# EAGLE design c64-uni-cart-rev5 (EAGLE 9.6.2)
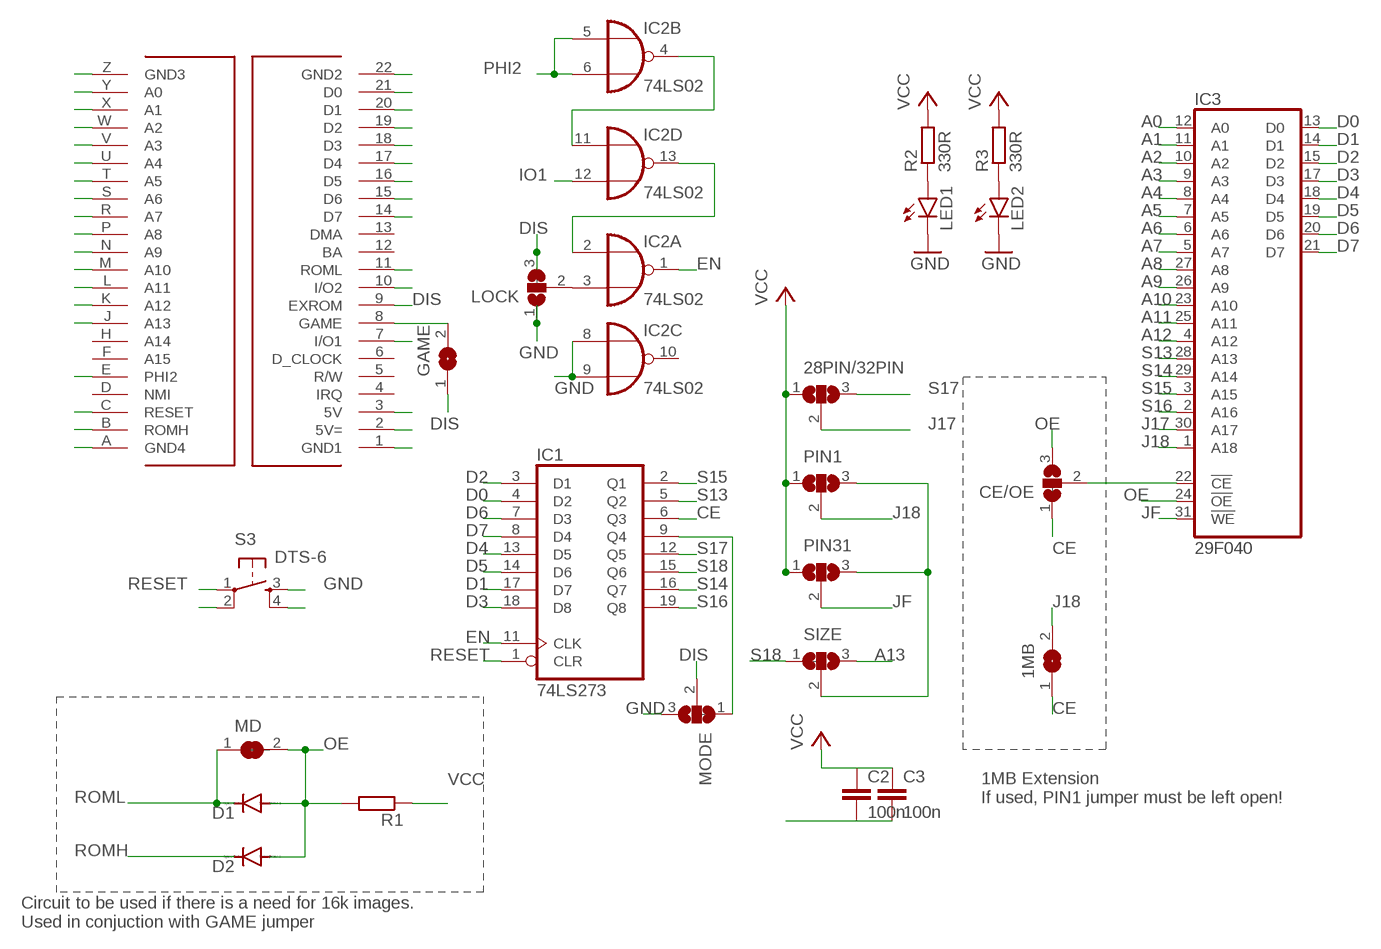
[diagram p0: schematic, sheet 1]

## Parts
1MB  SJ  [SJ]
28PIN/32PIN  SJ2W  [SJ_2]
C2  100n  C-EU025-024X044  [C025-024X044]
C3  100n  C-EU025-024X044  [C025-024X044]
CE/OE  SJ2W  [SJ_2]
D1  DIODE-MINIMELF  [MINIMELF]
D2  DIODE-MINIMELF  [MINIMELF]
GAME  SJ  [SJ]
IC1  74LS273  74HCT273N  [DIL20]
IC2  74LS02  74LS02N  [DIL14]
IC3  29F040  AM29F040N  [DIL32-6]
LED1  LED3MM  [LED3MM]
LED2  LED3MM  [LED3MM]
LOCK  SJ2W  [SJ_2]
MD  SJ  [SJ]
MODE  SJ2W  [SJ_2]
PIN1  SJ2W  [SJ_2]
PIN31  SJ2W  [SJ_2]
R1  R-EU_R1206  [R1206]
R2  330R  R-EU_R0805  [R0805]
R3  330R  R-EU_R0805  [R0805]
S3  DTS-6  [DTS-6]
SIZE  SJ2W  [SJ_2]
U$1  C64_CARTRIDGESTUMPY  [C64_STUMPY]

## Nets
A0: IC3.12(A0) U$1.Y(A0)
A1: IC3.11(A1) U$1.X(A1)
A2: IC3.10(A2) U$1.W(A2)
A3: IC3.9(A3) U$1.V(A3)
A4: IC3.8(A4) U$1.U(A4)
A5: IC3.7(A5) U$1.T(A5)
A6: IC3.6(A6) U$1.S(A6)
A7: IC3.5(A7) U$1.R(A7)
A8: IC3.27(A8) U$1.P(A8)
A9: IC3.26(A9) U$1.N(A9)
A10: IC3.23(A10) U$1.M(A10)
A11: IC3.25(A11) U$1.L(A11)
A12: IC3.4(A12) U$1.K(A12)
A13: SIZE.3 U$1.J(A13)
CE: 1MB.1 CE/OE.1 IC1.6(Q3)
D0: IC1.4(D2) IC3.13(D0) U$1.21(D0)
D1: IC1.17(D7) IC3.14(D1) U$1.20(D1)
D2: IC1.3(D1) IC3.15(D2) U$1.19(D2)
D3: IC1.18(D8) IC3.17(D3) U$1.18(D3)
D4: IC1.13(D5) IC3.18(D4) U$1.17(D4)
D5: IC1.14(D6) IC3.19(D5) U$1.16(D5)
D6: IC1.7(D3) IC3.20(D6) U$1.15(D6)
D7: IC1.8(D4) IC3.21(D7) U$1.14(D7)
DIS: GAME.1 LOCK.3 MODE.2 U$1.9(EXROM)
EN: IC1.11(CLK) IC2.1(A:O)
GND: C2.2 C3.2 IC2.8(C:I0) IC2.9(C:I1) LED1.K(C) LED2.K(C) LOCK.1 MODE.3 S3.3 S3.4 U$1.1(GND1) U$1.22(GND2) U$1.A(GND4) U$1.Z(GND3)
IO1: IC2.12(D:I1) U$1.7(I/O1)
IO2: U$1.10(I/O2)
J17: 28PIN/32PIN.2 IC3.30(A17)
J18: 1MB.2 IC3.1(A18) PIN1.2
JF: IC3.31(!WE) PIN31.2
N$1: GAME.2 U$1.8(GAME)
N$2: IC2.3(A:I1) LOCK.2
N$4: CE/OE.2 IC3.22(!CE)
N$5: PIN1.3 PIN31.3 SIZE.2
N$6: IC1.9(Q4) MODE.1
N$7: IC2.4(B:O) IC2.11(D:I0)
N$9: IC2.2(A:I0) IC2.13(D:O)
N$13: LED1.A R2.1
N$14: LED2.A R3.1
OE: CE/OE.3 D1.A D2.A IC3.24(!OE) MD.2 R1.2
PHI2: IC2.5(B:I0) IC2.6(B:I1) U$1.E(PHI2)
RESET: IC1.1(CLR) S3.1 S3.2 U$1.C(RESET)
ROMH: D2.C U$1.B(ROMH)
ROML: D1.C MD.1 U$1.11(ROML)
S13: IC1.5(Q2) IC3.28(A13)
S14: IC1.16(Q7) IC3.29(A14)
S15: IC1.2(Q1) IC3.3(A15)
S16: IC1.19(Q8) IC3.2(A16)
S17: 28PIN/32PIN.3 IC1.12(Q5)
S18: IC1.15(Q6) SIZE.1
VCC: 28PIN/32PIN.1 C2.1 C3.1 PIN1.1 PIN31.1 R1.1 R2.2 R3.2 U$1.2(5V=) U$1.3(5V)
Unconnected: IC2.10(C:O) U$1.4(IRQ) U$1.5(R/W) U$1.6(D_CLOCK) U$1.12(BA) U$1.13(DMA) U$1.D(NMI) U$1.F(A15) U$1.H(A14)

## Notes on the sheet
- 1MB Extension
  If used, PIN1 jumper must be left open!
- Circuit to be used if there is a need for 16k images.
  Used in conjuction with GAME jumper

## Power pins joined to a net without a drawn wire
GND: IC1.10(GND) IC2.7(P:GND) IC3.16(GND)
VCC: IC1.20(VCC) IC2.14(P:VCC) IC3.32(VCC)

## Library data of the parts
1MB GAME MD = jumper:SJ: SMD solder JUMPER
28PIN/32PIN CE/OE LOCK MODE PIN1 PIN31 SIZE = jumper:SJ2W: SMD solder JUMPER
C2 C3 = rcl:C-EU: CAPACITOR, European symbol
D1 D2 = diode:DIODE-: DIODE
IC1 = 74xx-eu:74*273: Octal D type FLIP FLOP, clear
IC2 = 74xx-eu:74*02: Quad 2-input NOR gate
IC3 = 0RB_Memory:AM29F040: 4-Megabit FLASH MEMORY (512 K x 8 bit) 5 V-only
LED1 LED2 = led:LED: LED OSRAM: - CHIPLED LG R971, LG N971, LY N971, LG Q971, LY Q971, LO R971, LY R971 LH N974, LH R974 LS Q976, LO Q976, LY Q976 LO Q996 - Hyper CHIPLED LW Q18S LB Q993, LB Q99A, LB R99A - SideLED LS A670, LO A670, LY A670, LG A670, LP A670 LB A673, LV A673, LT A673, LW A673 LH A674 LY A675 LS A676, LA A676, LO A676, LY A676, LW A676 LS A679, LY A679, LG A679 - Hyper Micro SIDELED® LS Y876, LA Y876, LO Y876, LY Y876 LT Y87S - SmartLED LW L88C, LW L88S LB L89C, LB L89S, LG L890 LS L89K, LO L89K, LY L89K LS L896, LA L896, LO L896, LY L896 - TOPLED LS T670, LO T670, LY T670, LG T670, LP T670 LSG T670, LSP T670, LSY T670, LOP T670, LYG T670 LG T671, LOG T671, LSG T671 LB T673, LV T673, LT T673, LW T673 LH T674 LS T676, LA T676, LO T676, LY T676, LB T676, LH T676, LSB T676, LW T676 LB T67C, LV T67C, LT T67C, LS T67K, LO T67K, LY T67K, LW E67C LS E67B, LA E67B, LO E67B, LY E67B, LB E67C, LV E67C, LT E67C LW T67C LS T679, LY T679, LG T679 LS T770, LO T770, LY T770, LG T770, LP T770 LB T773, LV T773, LT T773, LW T773 LH T774 LS E675, LA E675, LY E675, LS T675 LS T776, LA T776, LO T776, LY T776, LB T776 LHGB T686 LT T68C, LB T68C - Hyper Mini TOPLED® LB M676 - Mini TOPLED Santana® LG M470 LS M47K, LO M47K, LY M47K Source: http://www.osram.convergy.de LUXEON: - LUMILED® LXK2-PW12-R00, LXK2-PW12-S00, LXK2-PW14-U00, LXK2-PW14-V00 LXK2-PM12-R00, LXK2-PM12-S00, LXK2-PM14-U00 LXK2-PE12-Q00, LXK2-PE12-R00, LXK2-PE12-S00, LXK2-PE14-T00, LXK2-PE14-U00 LXK2-PB12-K00, LXK2-PB12-L00, LXK2-PB12-M00, LXK2-PB14-N00, LXK2-PB14-P00, LXK2-PB14-Q00 LXK2-PR12-L00, LXK2-PR12-M00, LXK2-PR14-Q00, LXK2-PR14-R00 LXK2-PD12-Q00, LXK2-PD12-R00, LXK2-PD12-S00 LXK2-PH12-R00, LXK2-PH12-S00 LXK2-PL12-P00, LXK2-PL12-Q00, LXK2-PL12-R00 Source: www.luxeon.com KINGBRIGHT: KA-3528ASYC Source: www.kingbright.com
R1-R3 = rcl:R-EU_: RESISTOR, European symbol; SPICEPREFIX: R
S3 = switch-tact:DTS-6
U$1 = 64kb_cart-twoboxes-short:C64_CARTRIDGE

## Board
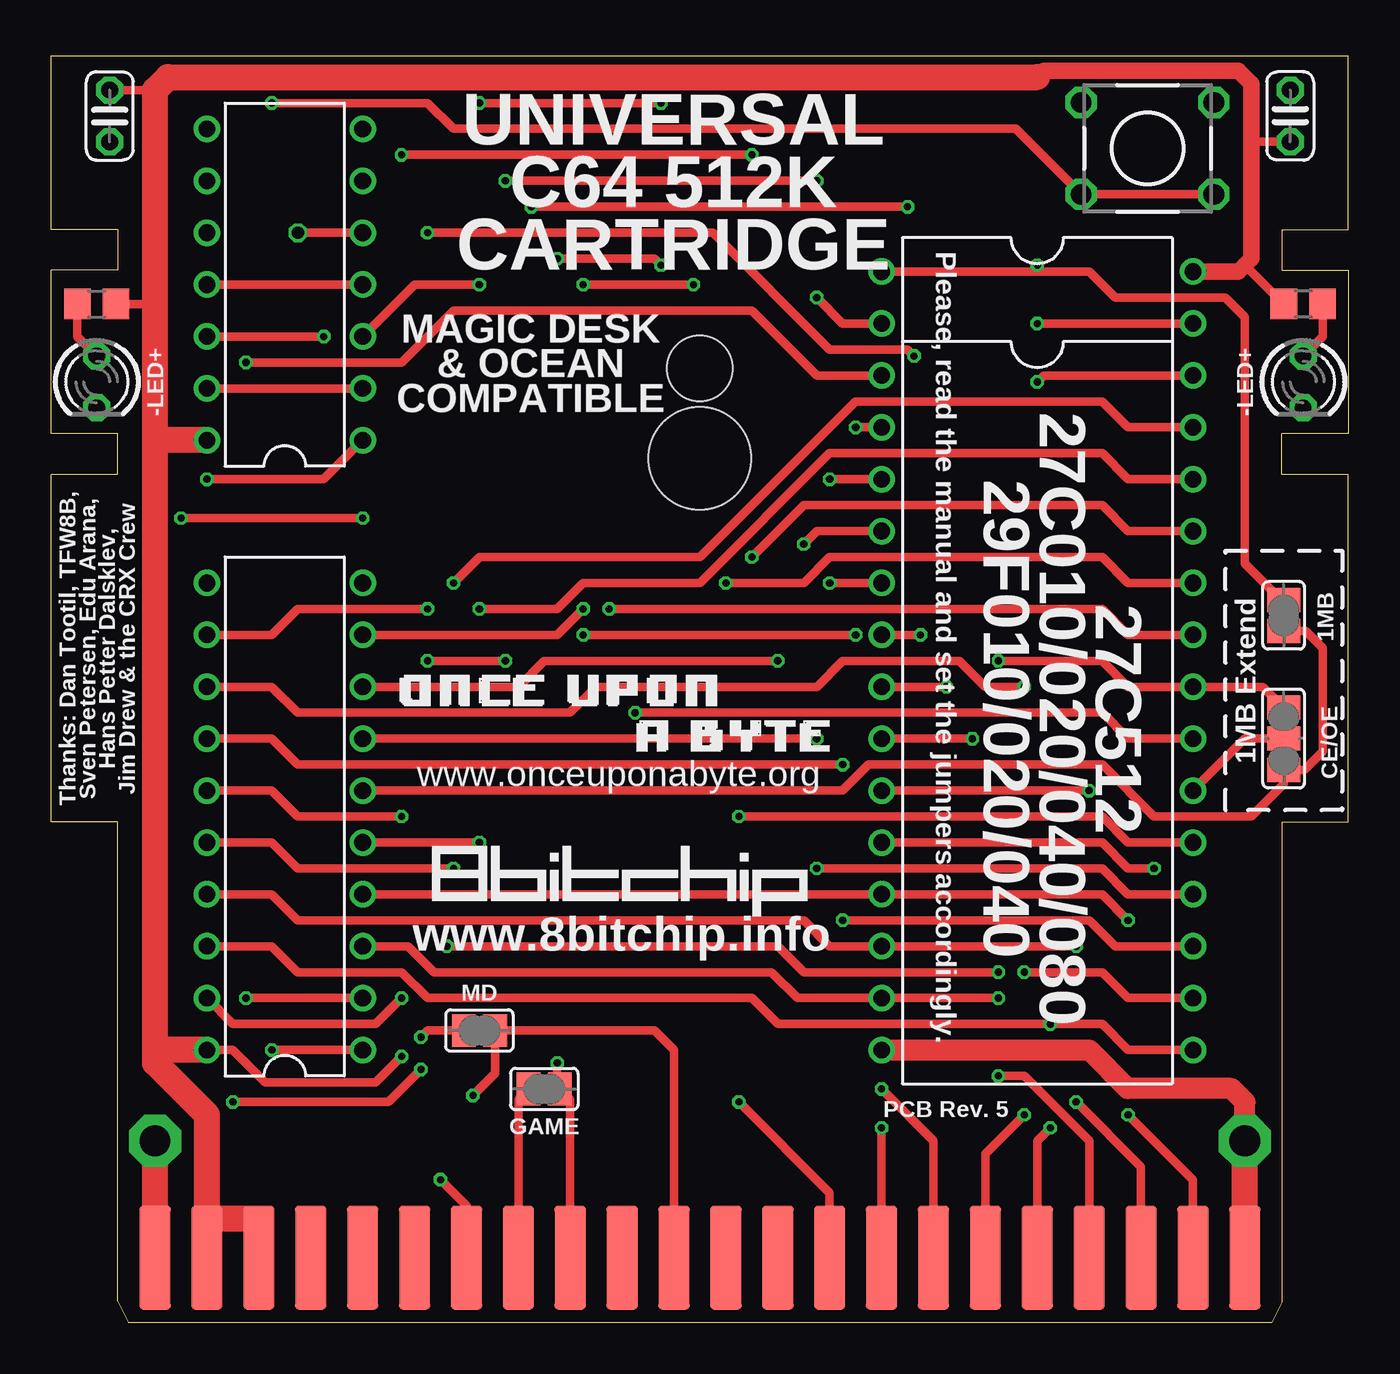
[diagram p1: board, top side]
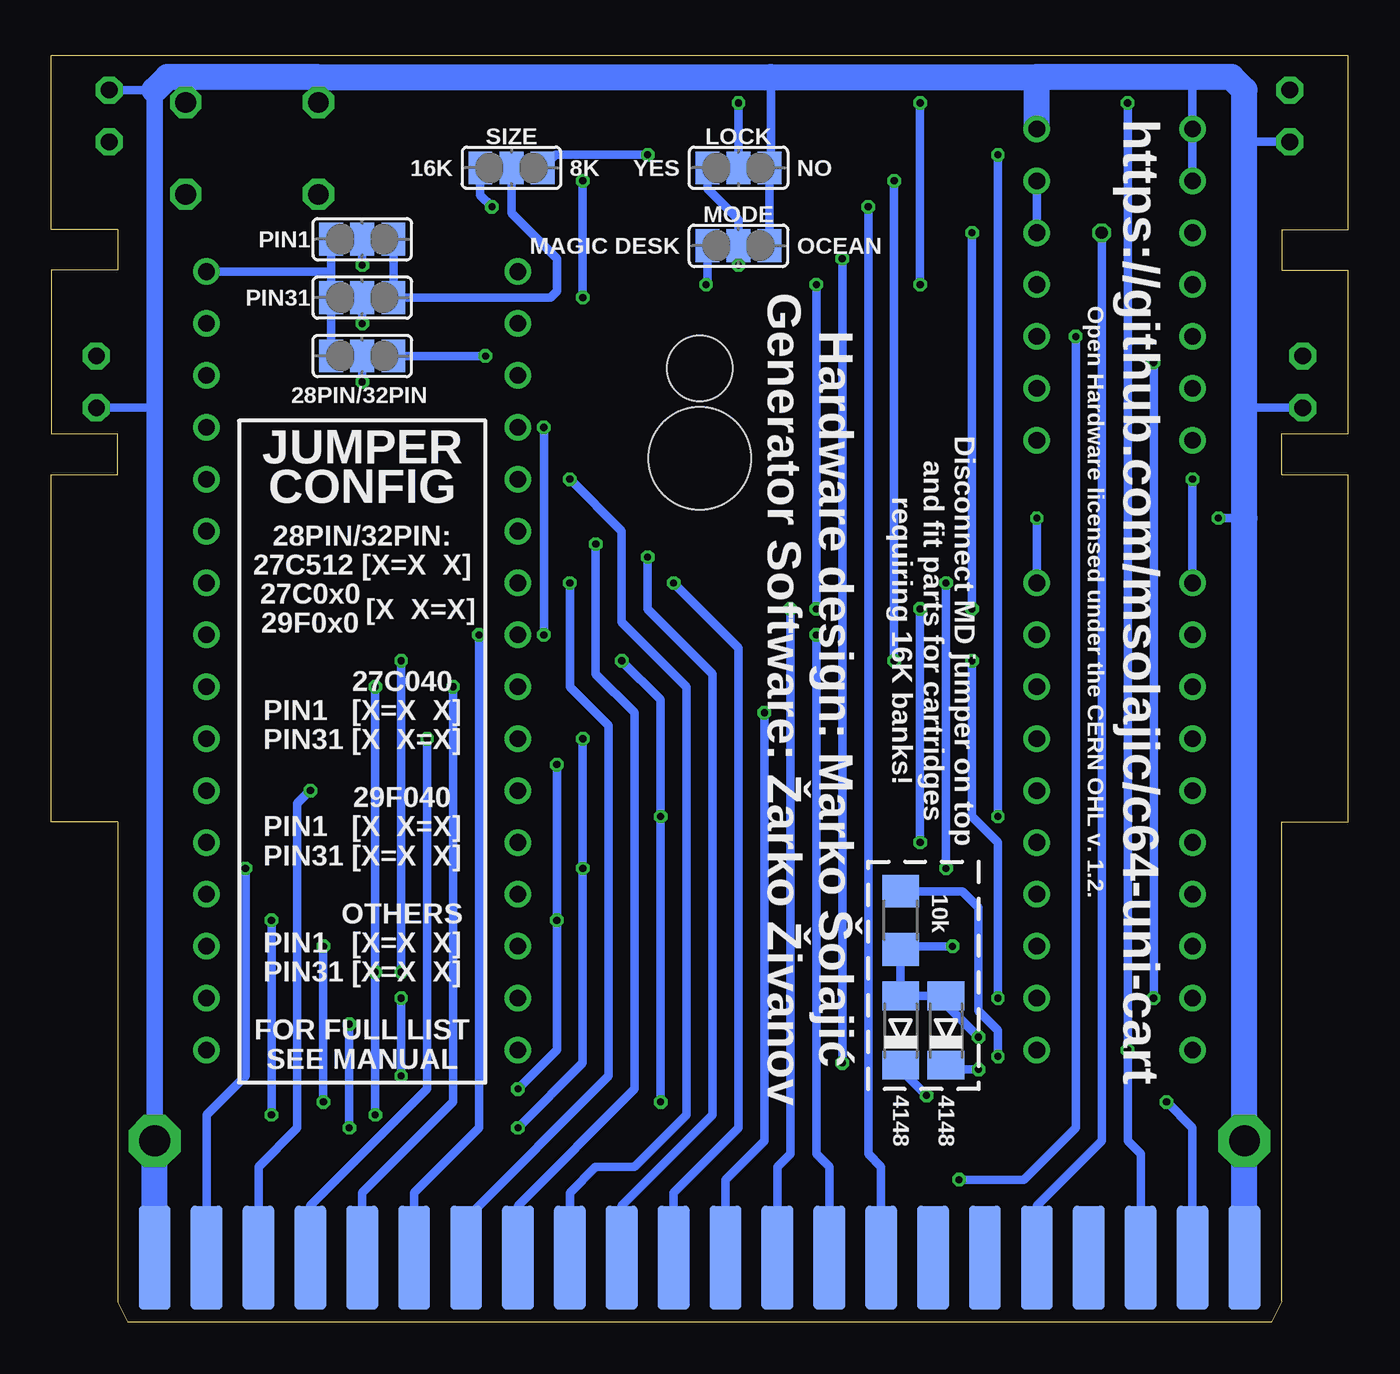
[diagram p2: board, bottom side, seen from below]

Size 63.5 x 62 mm. Coordinates in mm from the lower left corner, seen from the top.
Copper layers (1*16): Top 0.035mm / dielectric 1.5mm / Bottom 0.035mm
Design rules "SeeedStudio_2layer_DRU_no_angle_20140221 *": minimum track width 6mil, minimum drill 12mil, track to track 6mil, track to pad 6mil, pad to pad 6mil, via to via 6mil, smd to smd 0mil, copper to edge 10mil, drill to drill 10mil, minimum pad ring 10mil, minimum via ring 6mil, stop-mask expansion 2mil, vias tented up to drill 100mil, thermal gap 10mil

### Footprints (pad centres in the part's own frame; a part is rotated, then mirrored left to right if it is on the bottom)
SJ = smd 1.168 x 1.6: 1 -0.762,0; 2 0.762,0
SJ_2 = smd 1.168 x 1.6: 1 -1.524,0; 2 0,0; 3 1.524,0
C025-024X044 = drill 0.813 octagon: 1 -1.27,0; 2 1.27,0
MINIMELF = smd 1.4 x 1.8: A 1.7,0; C -1.7,0
DIL20 = drill 0.813 long: 1 -11.43,-3.81; 2 -8.89,-3.81; 3 -6.35,-3.81; 4 -3.81,-3.81; 5 -1.27,-3.81; 6 1.27,-3.81; 7 3.81,-3.81; 8 6.35,-3.81; 9 8.89,-3.81; 10 11.43,-3.81; 11 11.43,3.81; 12 8.89,3.81; 13 6.35,3.81; 14 3.81,3.81; 15 1.27,3.81; 16 -1.27,3.81; 17 -3.81,3.81; 18 -6.35,3.81; 19 -8.89,3.81; 20 -11.43,3.81
DIL14 = drill 0.813 long: 1 -7.62,-3.81; 2 -5.08,-3.81; 3 -2.54,-3.81; 4 0,-3.81; 5 2.54,-3.81; 6 5.08,-3.81; 7 7.62,-3.81; 8 7.62,3.81; 9 5.08,3.81; 10 2.54,3.81; 11 0,3.81; 12 -2.54,3.81; 13 -5.08,3.81; 14 -7.62,3.81
DIL32-6 = drill 0.813 long: 1 -19.05,-7.62; 2 -16.51,-7.62; 3 -13.97,-7.62; 4 -11.43,-7.62; 5 -8.89,-7.62; 6 -6.35,-7.62; 7 -3.81,-7.62; 8 -1.27,-7.62; 9 1.27,-7.62; 10 3.81,-7.62; 11 6.35,-7.62; 12 8.89,-7.62; 13 11.43,-7.62; 14 13.97,-7.62; 15 16.51,-7.62; 16 19.05,-7.62; 17 19.05,7.62; 18 16.51,7.62; 19 13.97,7.62; 20 11.43,7.62; 21 8.89,7.62; 22 6.35,7.62; 23 3.81,7.62; 24 1.27,7.62; 25 -1.27,7.62; 26 -3.81,7.62; 27 -6.35,7.62; 28 -8.89,7.62; 29 -11.43,7.62; 30 -13.97,7.62; 31 -16.51,7.62; 32 -19.05,7.62
LED3MM = drill 0.813 octagon: A -1.27,0; K 1.27,0
R1206 = smd 1.6 x 1.803: 1 -1.422,0; 2 1.422,0
R0805 = smd 1.3 x 1.5: 1 -0.95,0; 2 0.95,0
DTS-6 = drill 1.016 octagon: 1 -3.25,2.25; 2 3.25,2.25; 3 -3.25,-2.25; 4 3.25,-2.25
C64_STUMPY = smd 1.524 x 5.08: 1 5.08,3.175; 2 7.62,3.175; 3 10.16,3.175; 4 12.7,3.175; 5 15.24,3.175; 6 17.78,3.175; 7 20.32,3.175; 8 22.86,3.175; 9 25.4,3.175; 10 27.94,3.175; 11 30.48,3.175; 12 33.02,3.175; 13 35.56,3.175; 14 38.1,3.175; 15 40.64,3.175; 16 43.18,3.175; 17 45.72,3.175; 18 48.26,3.175; 19 50.8,3.175; 20 53.34,3.175; 21 55.88,3.175; 22 58.42,3.175 | smd 1.524 x 5.08 bottom: A 5.08,3.175; B 7.62,3.175; C 10.16,3.175; D 12.7,3.175; E 15.24,3.175; F 17.78,3.175; H 20.32,3.175; J 22.86,3.175; K 25.4,3.175; L 27.94,3.175; M 30.48,3.175; N 33.02,3.175; P 35.56,3.175; R 38.1,3.175; S 40.64,3.175; T 43.18,3.175; U 45.72,3.175; V 48.26,3.175; W 50.8,3.175; X 53.34,3.175; Y 55.88,3.175; Z 58.42,3.175 | hole 5: 31.74,42.3 | hole 3.2: 31.74,46.7

### Placement (x,y rotation side)
1MB  60.34,34.61 90 top
28PIN/32PIN  48.27,47.31 0 bottom
C2  2.87,59.05 270 top
C3  60.65,59.05 90 top
CE/OE  60.34,28.57 90 top
D1  21.92,14.29 90 bottom
D2  19.7,14.29 90 bottom
GAME  24.14,11.43 180 top
IC1  11.44,24.77 90 top
IC2  11.44,50.8 90 top
IC3  48.27,32.38 270 top
LED1  2.23,46.04 270 top
LED2  61.29,46.04 270 top
LOCK  29.86,56.52 180 bottom
MD  20.96,14.29 180 top
MODE  29.86,52.7 0 bottom
PIN1  48.27,53.02 0 bottom
PIN31  48.27,50.16 0 bottom
R1  21.92,19.68 270 bottom
R2  2.23,49.85 0 top
R3  61.29,49.85 180 top
S3  53.67,57.47 180 top
SIZE  40.97,56.52 180 bottom
U$1  0.01,0 0 top

### Tracks (layer width: path | path; a pad name or v marks a point on that pad's centre or on a via)
A0  (via drill 0.35)
  Top 0.406: v53.98,22.23 52.71,22.23 51.45,23.5 IC3.12
  Bottom 0.406: U$1.Y 55.89,10.16 53.98,12.06 v53.98,22.23
A1  (via drill 0.35)
  Top 0.406: v50.81,26.04 IC3.11
  Bottom 0.406: U$1.X 53.35,7.62 51.45,9.53 51.45,25.4 v50.81,26.04
A2  (via drill 0.35)
  Top 0.406: v45.09,28.57 IC3.10
  Bottom 0.406: U$1.W 50.81,5.71 45.09,11.43 v45.09,28.57
A3  (via drill 0.35)
  Top 0.406: v43.82,31.11 IC3.9
  Bottom 0.406: U$1.V 48.27,6.35 43.82,10.79 v43.82,31.11
A4  (via drill 0.35)
  Top 0.406: v42.55,33.66 IC3.8
  Bottom 0.406: U$1.U 45.73,6.35 42.55,9.53 v42.55,33.66
A5  (via drill 0.35)
  Top 0.406: v38.11,36.2 IC3.7
  Bottom 0.406: U$1.T 43.19,5.08 36.2,12.06 36.2,29.21 38.11,31.11 v38.11,36.2
A6  (via drill 0.35)
  Top 0.406: IC3.6 37.48,38.73 v36.84,38.1
  Bottom 0.406: U$1.S 40.65,5.71 34.93,11.43 34.93,29.84 36.84,31.75 v36.84,38.1
A7  (via drill 0.35)
  Top 0.406: v38.11,41.27 IC3.5
  Bottom 0.406: U$1.R 38.11,6.35 36.84,7.62 34.93,7.62 32.39,10.16 32.39,31.11 35.57,34.29 35.57,38.73 v38.11,41.27
A8  (via drill 0.35)
  Top 0.406: IC3.27 52.71,38.73 51.45,40.01 36.84,40.01 v34.3,37.47
  Bottom 0.406: U$1.P 35.57,5.71 31.12,10.16 31.12,31.75 34.3,34.92 v34.3,37.47
A9  (via drill 0.35)
  Top 0.406: IC3.26 52.71,36.2 51.45,37.47 38.11,37.47 36.84,36.2 v33.03,36.2
  Bottom 0.406: U$1.N 33.03,6.35 29.86,9.53 29.86,33.02 v33.03,36.2
A10  (via drill 0.35)
  Top 0.406: v28.59,29.84 51.45,29.84 52.71,28.57 IC3.23
  Bottom 0.406: U$1.M 30.49,6.99 28.59,8.89 v28.59,29.84
A11  (via drill 0.35)
  Top 0.406: v27.32,34.92 51.45,34.92 52.71,33.66 IC3.25
  Bottom 0.406: U$1.L 27.95,7.62 27.32,8.26 v27.32,34.92
A12  (via drill 0.35)
  Top 0.406: v26.05,33.66 v39.38,33.66 | v39.38,43.81 IC3.4
  Bottom 0.406: U$1.K 25.41,7.62 26.05,8.26 v26.05,33.66 | v39.38,43.81 v39.38,33.66
A13  (via drill 0.35)
  Top 0.406: v41.92,54.61 v23.51,54.61
  Bottom 0.406: v23.51,54.61 23.51,8.26 22.87,7.62 U$1.J | SIZE.3 42.49,55.18 v41.92,54.61
CE
  Top 0.406: IC1.6 38.74,26.04 40.02,27.3 51.45,27.3 53.98,24.77 58.75,24.77 60.34,26.35 CE/OE.1 61.35,27.05 62.24,27.94 62.24,33.02 61.41,33.85 1MB.1
D0  (via drill 0.35)
  Top 0.406: U$1.21 55.89,6.99 v52.71,10.16 | v52.71,19.68 51.45,20.95 IC3.13 19.38,20.95 | IC1.4 19.38,20.95 | 19.38,20.95
  Bottom 0.406: v52.71,10.16 v52.71,19.68
D1  (via drill 0.35)
  Top 0.406: U$1.20 53.35,7.62 v50.17,10.79 | v50.17,18.41 IC3.14 38.11,18.41 36.84,19.68 12.07,19.68 10.8,20.95 IC1.17
  Bottom 0.406: v50.17,10.79 v50.17,18.41
D2  (via drill 0.35)
  Top 0.406: U$1.19 50.81,8.89 47.63,12.06 v46.36,12.06 | IC1.3 17.47,18.41 18.74,17.14 35.25,17.14 36.52,15.88 IC3.15 v46.36,15.88
  Bottom 0.406: v46.36,15.88 v46.36,12.06
D3  (via drill 0.35)
  Top 0.406: U$1.18 48.27,8.89 v48.91,9.53 | IC3.17 52.71,13.34 51.45,14.61 v48.91,14.61 35.57,14.61 34.3,15.88 19.7,15.88 18.43,15.88 17.16,17.14 12.07,17.14 10.8,18.41 IC1.18
  Bottom 0.406: v48.91,9.53 v48.91,14.61
D4  (via drill 0.35)
  Top 0.406: v47.63,17.14 51.45,17.14 52.71,15.88 IC3.18 | IC1.13 10.8,31.11 12.07,29.84 25.41,29.84 26.68,31.11 37.48,31.11 38.74,32.38 44.46,32.38 45.73,31.11 v47.63,31.11 | U$1.17 45.73,8.26 v47.63,10.16
  Bottom 0.406: v47.63,10.16 v47.63,17.14 v47.63,31.11
D5  (via drill 0.35)
  Top 0.406: U$1.16 43.19,8.89 v40.65,11.43 | v38.74,19.68 50.81,19.68 52.08,18.41 IC3.19 | IC1.14 10.8,28.57 12.07,27.3 v38.74,27.3
  Bottom 0.406: v40.65,11.43 38.74,13.34 v38.74,19.68 v38.74,27.3
D6  (via drill 0.35)
  Top 0.406: U$1.15 v40.65,9.53 | v37.48,22.23 51.45,22.23 52.71,20.95 IC3.20 | IC1.7 v37.48,28.57
  Bottom 0.406: v40.65,9.53 37.48,12.7 v37.48,22.23 v37.48,28.57
D7  (via drill 0.35)
  Top 0.406: U$1.14 38.11,6.35 v33.66,10.79 | v33.66,24.77 51.45,24.77 52.71,23.5 IC3.21 | IC1.8 22.87,31.11 24.14,32.38 v35.57,32.38
  Bottom 0.406: v33.66,10.79 v33.66,24.77 33.66,30.48 v35.57,32.38
DIS  (via drill 0.35)
  Top 0.406: v24.78,52.07 29.54,52.07 v29.86,51.75 | U$1.9 25.41,10.92 GAME.1 24.78,11.56 v24.78,12.7
  Bottom 0.406: LOCK.3 31.38,55.5 29.86,53.98 MODE.2 v29.86,51.75 | v24.78,52.07 v24.78,12.7
EN  (via drill 0.35)
  Top 0.406: v7.63,41.27 13.35,41.27 IC2.1
  Bottom 0.406: IC1.11 v7.63,41.27
GND  (via drill 0.35, 1.5 pad 2.54)
  Top 0.406: v15.25,39.37 v6.36,39.37
  Top 1.016: IC3.16 50.81,13.34 52.69,11.46 57.77,11.46 58.43,10.79 v58.43,8.89
  Top 1.27: U$1.22 v58.43,8.89 | U$1.A v5.09,8.89
  Bottom 0.406: IC2.9 IC2.8 7.63,60.96 | C3.2 58.43,60.33 | C2.2 5.09,57.78 | v6.36,39.37 5.09,39.37 | IC1.10 v15.25,39.37 | S3.4 50.42,60.88 | S3.3 56.92,60.88 56.84,60.96 | MODE.3 LOCK.1 28.27,56.58 28.27,60.96 | LED1.K 5.09,44.77 | LED2.K 58.43,44.77
  Bottom 0.813: 50.42,60.88 50.49,60.96 | 58.43,60.33 58.43,44.77 v58.43,8.89
  Bottom 1.27: 15.25,60.96 7.63,60.96 5.72,60.96 5.09,60.33 5.09,57.78 5.09,44.77 5.09,39.37 v5.09,8.89 U$1.A | IC2.7 15.25,60.96 | 15.25,60.96 28.27,60.96 50.49,60.96 56.84,60.96 57.79,60.96 58.43,60.33 | U$1.22 v58.43,8.89
IO1  (via drill 0.35)
  Top 0.406: U$1.7 20.33,5.71 v19.06,6.99 | v13.35,48.26 IC2.12
  Bottom 0.406: v19.06,6.99 15.88,6.99 13.35,9.53 v13.35,48.26
J17  (via drill 0.35)
  Top 0.406: v48.27,46.04 48.59,46.35 IC3.30
  Bottom 0.406: v48.27,46.04 28PIN/32PIN.2
J18  (via drill 0.35)
  Top 0.406: 1MB.2 60.21,35.37 58.43,37.15 58.43,49.21 57.48,50.16 52.08,50.16 50.81,51.44 48.27,51.44 | IC3.1 48.27,51.44 | v48.27,51.75 48.27,51.44
  Bottom 0.406: v48.27,51.75 PIN1.2
JF  (via drill 0.35)
  Top 0.406: IC3.31 v48.27,48.9
  Bottom 0.406: v48.27,48.9 PIN31.2
N$1
  Top 0.406: U$1.8 22.87,10.92 GAME.2
N$2  (via drill 0.35)
  Top 0.406: IC2.3 17.79,50.8 v20.96,50.8 | v29.86,59.69 v20.96,59.69
  Bottom 0.406: v20.96,50.8 v20.96,59.69 | v29.86,59.69 LOCK.2
N$3
  Top 0.203: 20.33,14.29 21.6,14.29
N$4
  Top 0.406: IC3.22 58.43,28.57 CE/OE.2
N$5
  Bottom 0.406: PIN1.3 PIN31.3 39.06,50.16 38.74,50.48 38.74,52.07 40.97,54.29 SIZE.2
N$6  (via drill 0.35)
  Top 0.406: IC1.9 24.78,33.66 v26.05,34.92 | v26.05,50.8 v31.44,50.8
  Bottom 0.406: v26.05,34.92 v26.05,50.8 | v31.44,50.8 31.38,50.86 MODE.1
N$7
  Top 0.406: IC2.11 IC2.4
N$8
  Bottom 0.203: 40.65,56.52 39.7,56.52
N$9
  Top 0.406: IC2.13 IC2.2
N$10
  Bottom 0.203: 31.12,56.52 30.17,56.52
N$11
  Bottom 0.203: 31.12,52.7 30.17,52.7
N$12
  Top 0.203: 60.34,27.3 60.34,28.26
N$13
  Top 0.406: R2.1 1.28,48.26 LED1.A
N$14
  Top 0.406: R3.1 62.24,48.26 LED2.A
OE  (via drill 0.35)
  Top 0.406: v46.36,32.38 51.45,32.38 52.71,31.11 IC3.24 59.32,31.11 CE/OE.3 | v19.38,18.41 35.57,18.41 36.84,17.14 v46.36,17.14 | v18.11,13.97 18.43,14.29 MD.2
  Bottom 0.406: v46.36,32.38 v46.36,17.14 | v19.38,18.41 21.77,18.41 R1.2 D1.A D2.A 19.7,15.56 v18.11,13.97
PHI2  (via drill 0.6)
  Top 0.406: v12.07,53.34 IC2.5
  Bottom 0.406: IC2.6 IC2.5 | U$1.E 15.25,5.71 12.07,8.89 v12.07,53.34
RESET  (via drill 0.35)
  Top 0.406: IC1.1 v10.8,13.34 | S3.1 S3.2 47.21,58.42 19.7,58.42 18.43,59.69 v10.8,59.69
  Bottom 0.406: U$1.C 10.17,8.26 10.8,8.89 v10.8,13.34 v10.8,59.69
ROMH  (via drill 0.35)
  Top 0.406: v8.9,10.79 16.52,10.79 v18.11,12.38
  Bottom 0.406: U$1.B 7.63,9.53 v8.9,10.79 | v18.11,12.38 19.49,12.38 D2.C
ROML  (via drill 0.35)
  Top 0.406: U$1.11 30.49,13.34 29.54,14.29 MD.1 21.73,12.19 v20.65,11.11
  Bottom 0.406: v20.65,11.11 21.92,12.38 D1.C
S13  (via drill 0.35)
  Top 0.406: IC3.28 52.71,41.27 51.45,42.55 38.11,42.55 31.76,36.2 26.05,36.2 24.78,34.92 v20.96,34.92 | v20.96,23.5 IC1.5
  Bottom 0.406: v20.96,34.92 v20.96,23.5
S14  (via drill 0.35)
  Top 0.406: IC3.29 52.71,43.81 51.45,45.09 39.38,45.09 31.76,37.47 20.96,37.47 v19.7,36.2 | v19.7,22.23 12.07,22.23 10.8,23.5 IC1.16
  Bottom 0.406: v19.7,36.2 v19.7,22.23
S15  (via drill 0.35)
  Top 0.406: IC3.3 37.48,46.35 34.3,49.53 19.7,49.53 17.16,46.99 v9.54,46.99 | v9.54,15.88 IC1.2
  Bottom 0.406: v9.54,46.99 v9.54,15.88
S16  (via drill 0.35)
  Top 0.406: IC1.19 8.9,14.61 15.88,14.61 v17.16,15.88 | v18.43,32.38 v22.24,32.38 | v37.48,55.88 v22.24,55.88 | v37.48,50.16 38.74,48.9 IC3.2
  Bottom 0.406: v18.43,32.38 18.43,24.77 17.16,23.5 v17.16,15.88 | v22.24,32.38 v22.24,55.88 | v37.48,55.88 v37.48,50.16
S17  (via drill 0.35)
  Top 0.406: v18.43,53.34 32.39,53.34 38.11,47.62 41.92,47.62 v42.24,47.31 | v18.43,34.92 12.07,34.92 10.8,33.66 IC1.12
  Bottom 0.406: v18.43,53.34 v18.43,34.92 | v42.24,47.31 28PIN/32PIN.3
S18  (via drill 0.35)
  Top 0.406: IC1.15 10.8,26.04 12.07,24.77 v17.16,24.77 | v34.3,57.15 v17.16,57.15
  Bottom 0.406: v17.16,24.77 v17.16,57.15 | SIZE.1 38.81,57.15 v34.3,57.15
VCC  (via drill 0.35)
  Top 0.406: C2.1 5.09,60.33 | IC1.20 8.9,13.34 10.49,11.75 15.88,11.75 v17.16,13.02 | C3.1 58.75,57.78 | R2.2 5.09,49.85 | R3.2 58.43,51.75
  Top 0.813: IC3.32 58.11,51.44 58.43,51.75 58.75,52.07 58.75,57.78 58.75,60.64 58.11,61.28 48.59,61.28 48.27,60.96
  Top 1.27: U$1.2 7.63,5.08 | 7.63,5.08 7.63,10.16 5.09,12.7 5.09,13.34 | 5.09,13.34 5.09,43.18 | 5.09,43.18 5.09,49.85 5.09,60.33 5.72,60.96 48.27,60.96 | IC1.20 5.09,13.34 | IC2.14 5.09,43.18 | U$1.3 10.17,5.08 7.63,5.08
  Bottom 0.406: PIN1.1 49.79,51.44 | 49.79,51.44 PIN31.1 28PIN/32PIN.1 | IC3.32 49.79,51.44 | v17.16,13.02 17.16,14.29 18.11,15.24 18.11,20.32 18.89,21.11 R1.1

### Text on the board
tNames: UNIVERSAL / C64 512K / CARTRIDGE | MAGIC DESK / & OCEAN / COMPATIBLE | -LED+ | -LED+ | Thanks: Dan Tootil, TFW8B, / Sven Petersen, Edu Arana, / Hans Petter Dalsklev, / Jim Drew & the CRX Crew | Please, read the manual and set the jumpers accordingly. | 1MB Extend | 27C512 / 27C010/020/040/080 / 29F010/020/040 | www.onceuponabyte.org | www.8bitchip.info | PCB Rev. 5
bNames: NO | YES | 8K | 16K | OCEAN | MAGIC DESK | JUMPER / CONFIG | https://github.com/msolajic/c64-uni-cart | Open Hardware licensed under the CERN OHL v. 1.2. | [X X=X] | Disconnect MD jumper on top / and fit parts for cartridges / requiring 16K banks! | Hardware design: Marko Šolajić / Generator Software: Žarko Živanov | 28PIN/32PIN: / 27C512 [X=X X] / 27C0x0 / 29F0x0 / / 27C040 / PIN1 [X=X X] / PIN31 [X X=X] / / 29F040 / PIN1 [X X=X] / PIN31 [X=X X] / / OTHERS / PIN1 [X=X X] / PIN31 [X=X X] / / FOR FULL LIST / SEE MANUAL | 10k | 4148 | 4148